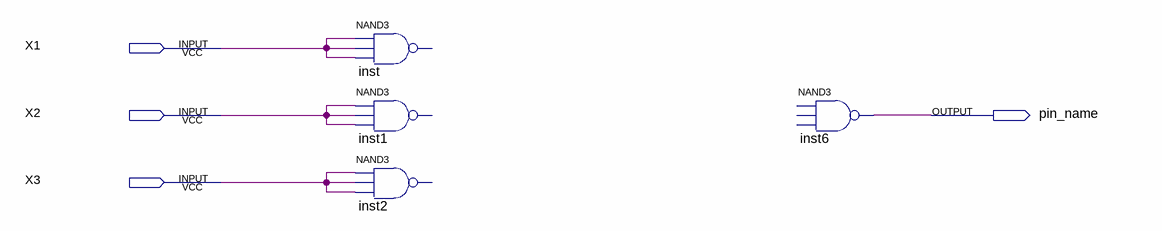
[diagram p0: schematic sheet]
// Quartus schematic Lab_4_part_2.bdf as structural Verilog: 4 symbols, 4 pins
module Lab_4_part_2 (
  input  X1,
  input  X2,
  input  X3,
  output pin_name
);

  // NAND3 inst has open pins: IN1=X1, IN2=X1, IN3=X1, OUT=open
  // NAND3 inst1 has open pins: IN1=X2, IN2=X2, IN3=X2, OUT=open
  // NAND3 inst2 has open pins: IN1=X3, IN2=X3, IN3=X3, OUT=open
  // NAND3 inst6 has open pins: IN1=open, IN2=open, IN3=open, OUT=pin_name
endmodule
